# Altium schematic sheet EVENTCTRL_ACQ.SchDoc: ACQ
size A2; Author: ZLY; DocumentNumber: 2; Revision: 1.0; SheetNumber: 2; SheetTotal: 6
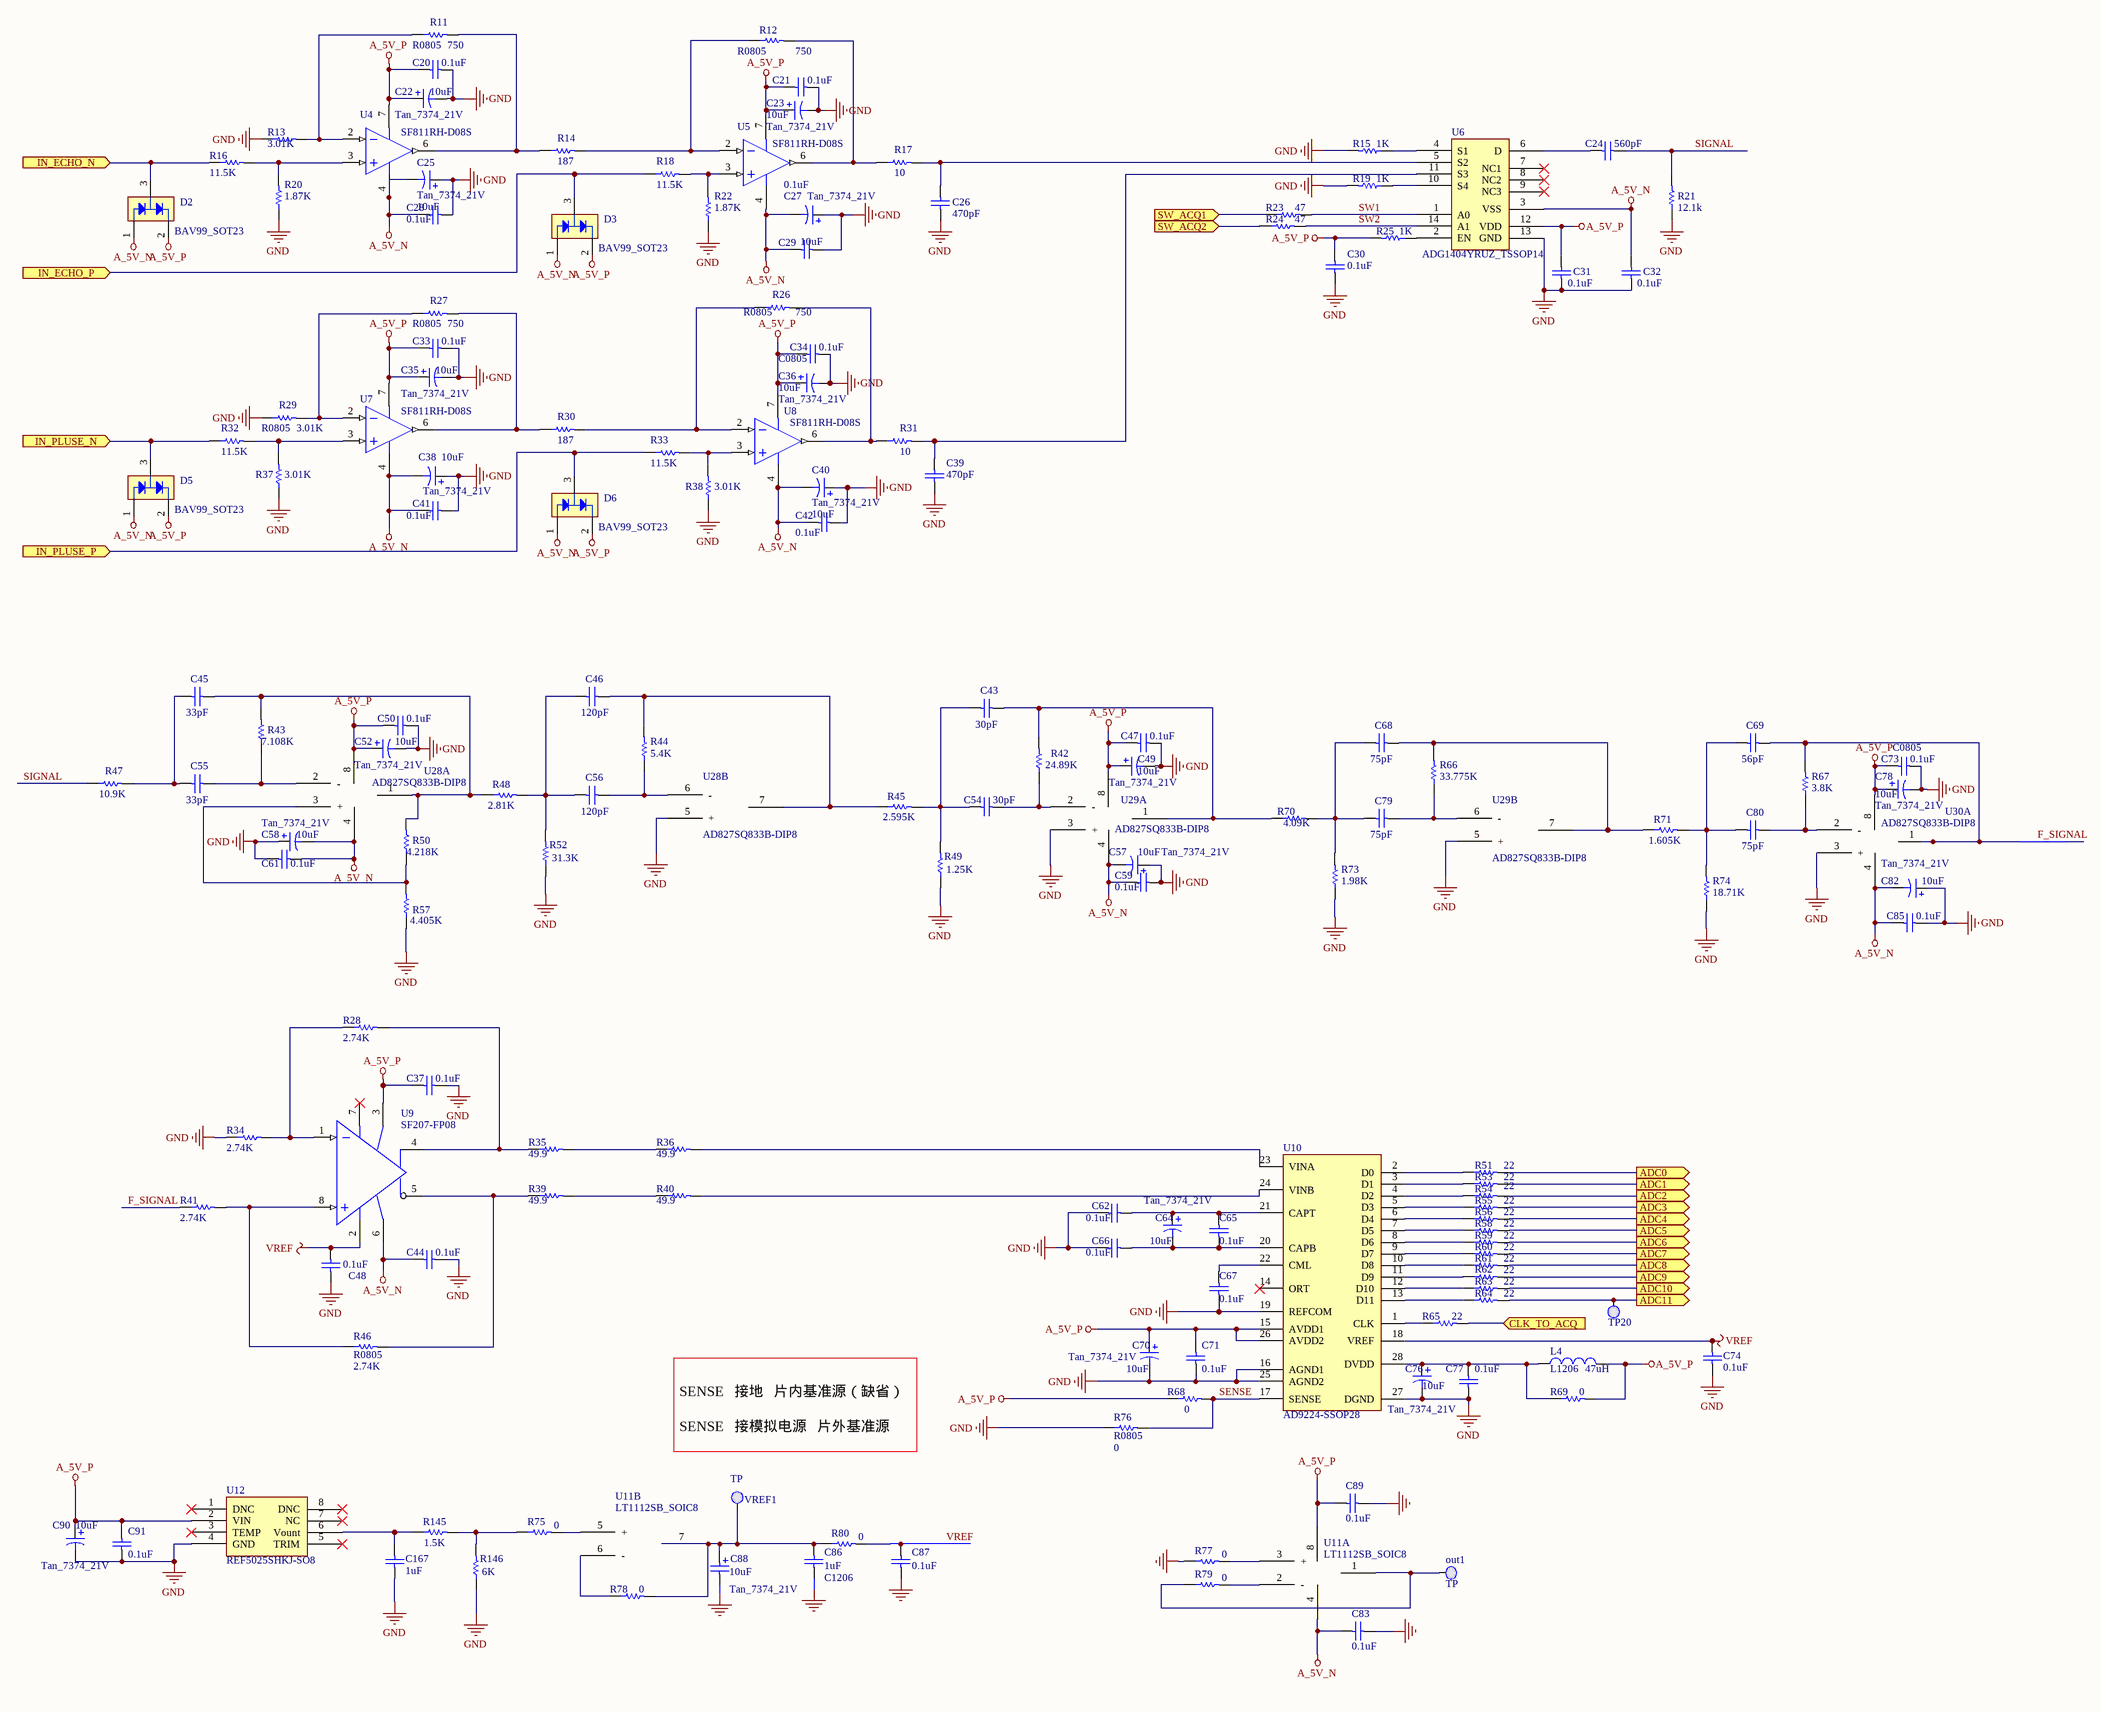
[diagram p0: EVENTCTRL_ACQ.SchDoc]

## Parts
C20  value 0.1uF  [0805]  (hidden comment: C0805)
C21  value 0.1uF  [0805]  (hidden comment: C0805)
C22  Tan_7374_21V  value 10uF  [7343]
C23  Tan_7374_21V  value 10uF  [7343]
C24  value 560pF  [0805]  (hidden comment: C0805)
C25  Tan_7374_21V  value 10uF  [7343]
C26  value 470pF  [0805]  (hidden comment: C0805)
C27  Tan_7374_21V  value 10uF  [7343]
C28  value 0.1uF  [0805]  (hidden comment: C0805)
C29  value 0.1uF  [0805]  (hidden comment: C0805)
C30  value 0.1uF  [0805]  (hidden comment: C0805)
C31  value 0.1uF  [0805]  (hidden comment: C0805)
C32  value 0.1uF  [0805]  (hidden comment: C0805)
C33  value 0.1uF  [0805]  (hidden comment: C0805)
C34  value 0.1uF  [0805]  (hidden comment: C0805)
C35  Tan_7374_21V  value 10uF  [7343]
C36  Tan_7374_21V  value 10uF  [7343]
C37  value 0.1uF  [0805]  (hidden comment: C0805)
C38  Tan_7374_21V  value 10uF  [7343]
C39  value 470pF  [0805]  (hidden comment: C0805)
C40  Tan_7374_21V  value 10uF  [7343]
C41  value 0.1uF  [0805]  (hidden comment: C0805)
C42  value 0.1uF  [0805]  (hidden comment: C0805)
C43  value 30pF  [0805]  (hidden comment: C0805)
C44  value 0.1uF  [0805]  (hidden comment: C0805)
C45  value 33pF  [0805]  (hidden comment: C0805)
C46  value 120pF  [0805]  (hidden comment: C0805)
C47  value 0.1uF  [0805]  (hidden comment: C0805)
C48  value 0.1uF  [0805]  (hidden comment: C0805)
C49  Tan_7374_21V  value 10uF  [7343]
C50  value 0.1uF  [0805]  (hidden comment: C0805)
C52  Tan_7374_21V  value 10uF  [7343]
C54  value 30pF  [0805]  (hidden comment: C0805)
C55  value 33pF  [0805]  (hidden comment: C0805)
C56  value 120pF  [0805]  (hidden comment: C0805)
C57  Tan_7374_21V  value 10uF  [7343]
C58  Tan_7374_21V  value 10uF  [7343]
C59  value 0.1uF  [0805]  (hidden comment: C0805)
C61  value 0.1uF  [0805]  (hidden comment: C0805)
C62  value 0.1uF  [0805]  (hidden comment: C0805)
C64  Tan_7374_21V  value 10uF  [7343]
C65  value 0.1uF  [0805]  (hidden comment: C0805)
C66  value 0.1uF  [0805]  (hidden comment: C0805)
C67  value 0.1uF  [0805]  (hidden comment: C0805)
C68  value 75pF  [0805]  (hidden comment: C0805)
C69  value 56pF  [0805]  (hidden comment: C0805)
C70  Tan_7374_21V  value 10uF  [7343]
C71  value 0.1uF  [0805]  (hidden comment: C0805)
C73  value 0.1uF  [0805]  (hidden comment: C0805)
C74  value 0.1uF  [0805]  (hidden comment: C0805)
C76  Tan_7374_21V  value 10uF  [7343]
C77  value 0.1uF  [0805]  (hidden comment: C0805)
C78  Tan_7374_21V  value 10uF  [7343]
C79  value 75pF  [0805]  (hidden comment: C0805)
C80  value 75pF  [0805]  (hidden comment: C0805)
C82  Tan_7374_21V  value 10uF  [7343]
C83  value 0.1uF  [0805]  (hidden comment: C0805)
C85  value 0.1uF  [0805]  (hidden comment: C0805)
C86  C1206  value 1uF  [1206]
C87  value 0.1uF  [0805]  (hidden comment: C0805)
C88  Tan_7374_21V  value 10uF  [7343]
C89  value 0.1uF  [0805]  (hidden comment: C0805)
C90  Tan_7374_21V  value 10uF  [7343]
C91  value 0.1uF  [0805]  (hidden comment: C0805)
C167  value 1uF  [1206]  (hidden comment: C1206)
D2  BAV99_SOT23  [SOT23-3N]
D3  BAV99_SOT23  [SOT23-3N]
D5  BAV99_SOT23  [SOT23-3N]
D6  BAV99_SOT23  [SOT23-3N]
L4  L1206  value 47uH  [1206]
out1  TP  [TPA]
R11  value 750  [R0805]  (hidden comment: R0805)
R12  R0805  value 750  [R0805]
R13  value 3.01K  [R0805]  (hidden comment: R0805)
R14  value 187  [R0805]  (hidden comment: R0805)
R15  value 1K  [R0805]  (hidden comment: R0805)
R16  value 11.5K  [R0805]  (hidden comment: R0805)
R17  value 10  [R0805]  (hidden comment: R0805)
R18  value 11.5K  [R0805]  (hidden comment: R0805)
R19  value 1K  [R0805]  (hidden comment: R0805)
R20  value 1.87K  [R0805]  (hidden comment: R0805)
R21  value 12.1k  [R0805]  (hidden comment: R0805)
R22  value 1.87K  [R0805]  (hidden comment: R0805)
R23  value 47  [R0805]  (hidden comment: R0805)
R24  value 47  [R0805]  (hidden comment: R0805)
R25  value 1K  [R0805]  (hidden comment: R0805)
R26  value 750  [R0805]  (hidden comment: R0805)
R27  value 750  [R0805]  (hidden comment: R0805)
R28  value 2.74K  [R0805]  (hidden comment: R0805)
R29  value 3.01K  [R0805]  (hidden comment: R0805)
R30  value 187  [R0805]  (hidden comment: R0805)
R31  value 10  [R0805]  (hidden comment: R0805)
R32  value 11.5K  [R0805]  (hidden comment: R0805)
R33  value 11.5K  [R0805]  (hidden comment: R0805)
R34  value 2.74K  [R0805]  (hidden comment: R0805)
R35  value 49.9  [R0805]  (hidden comment: R0805)
R36  value 49.9  [R0805]  (hidden comment: R0805)
R37  value 3.01K  [R0805]  (hidden comment: R0805)
R38  value 3.01K  [R0805]  (hidden comment: R0805)
R39  value 49.9  [R0805]  (hidden comment: R0805)
R40  value 49.9  [R0805]  (hidden comment: R0805)
R41  value 2.74K  [R0805]  (hidden comment: R0805)
R42  value 24.89K  [R0805]  (hidden comment: R0805)
R43  value 7.108K  [R0805]  (hidden comment: R0805)
R44  value 5.4K  [R0805]  (hidden comment: R0805)
R45  value 2.595K  [R0805]  (hidden comment: R0805)
R46  R0805  value 2.74K  [R0805]
R47  value 10.9K  [R0805]  (hidden comment: R0805)
R48  value 2.81K  [R0805]  (hidden comment: R0805)
R49  value 1.25K  [R0805]  (hidden comment: R0805)
R50  value 4.218K  [R0805]  (hidden comment: R0805)
R51  value 22  [R0805]  (hidden comment: R0805)
R52  value 31.3K  [R0805]  (hidden comment: R0805)
R53  value 22  [R0805]  (hidden comment: R0805)
R54  value 22  [R0805]  (hidden comment: R0805)
R55  value 22  [R0805]  (hidden comment: R0805)
R56  value 22  [R0805]  (hidden comment: R0805)
R57  value 4.405K  [R0805]  (hidden comment: R0805)
R58  value 22  [R0805]  (hidden comment: R0805)
R59  value 22  [R0805]  (hidden comment: R0805)
R60  value 22  [R0805]  (hidden comment: R0805)
R61  value 22  [R0805]  (hidden comment: R0805)
R62  value 22  [R0805]  (hidden comment: R0805)
R63  value 22  [R0805]  (hidden comment: R0805)
R64  value 22  [R0805]  (hidden comment: R0805)
R65  value 22  [R0805]  (hidden comment: R0805)
R66  value 33.775K  [R0805]  (hidden comment: R0805)
R67  value 3.8K  [R0805]  (hidden comment: R0805)
R68  value 0  [R0805]  (hidden comment: R0805)
R69  value 0  [R0805]  (hidden comment: R0805)
R70  value 4.09K  [R0805]  (hidden comment: R0805)
R71  value 1.605K  [R0805]  (hidden comment: R0805)
R73  value 1.98K  [R0805]  (hidden comment: R0805)
R74  value 18.71K  [R0805]  (hidden comment: R0805)
R75  value 0  [R0805]  (hidden comment: R0805)
R76  value 0  [R0805]  (hidden comment: R0805)
R77  value 0  [R0805]  (hidden comment: R0805)
R78  value 0  [R0805]  (hidden comment: R0805)
R79  value 0  [R0805]  (hidden comment: R0805)
R80  value 0  [R0805]  (hidden comment: R0805)
R145  value 1.5K  [R0805]  (hidden comment: R0805)
R146  value 6K  [R0805]  (hidden comment: R0805)
TP20  TP  [TPA]  (value not drawn)
U4  SF811RH-D08S  [DIP8]
U5  SF811RH-D08S  [DIP8]
U6  ADG1404YRUZ_TSSOP14  [TSSOP14]
U7  SF811RH-D08S  [DIP8]
U8  SF811RH-D08S  [DIP8]
U9  SF207-FP08  [SO-8]
U10  AD9224-SSOP28  [TSSOP28]
U11  LT1112SB_SOIC8  [SO-8]  (parts A,B of 2)
U12  REF5025SHKJ-SO8  [SO8-HKJ]
U28  AD827SQ833B-DIP8  [DIP8]  (parts A,B of 2)
U29  AD827SQ833B-DIP8  [DIP8]  (parts A,B of 2)
U30  AD827SQ833B-DIP8  [DIP8]  (part A of 2)
VREF1  TP  [TPA]

## Ports
ADC0 (out), ADC1 (out), ADC2 (out), ADC3 (out), ADC4 (out), ADC5 (out), ADC6 (out), ADC7 (out), ADC8 (out), ADC9 (out), ADC10 (out), ADC11 (out), CLK_TO_ACQ (in), IN_ECHO_N (in), IN_ECHO_P (in), IN_PLUSE_N (in), IN_PLUSE_P (in), SW_ACQ1 (in), SW_ACQ2 (in)

## Nets
A_5V_N: C25.2 C27.2 C28.1 C29.1 C32.1 C38.2 C40.2 C41.1 C42.1 C44.1 C57.2 C58.2 C59.1 C61.2 C82.2 C83.2 C85.1 D2.1 D3.1 D5.1 D6.1 U4.4(-VS) U5.4(-VS) U6.3(VSS) U7.4(-VS) U8.4(-VS) U9.6(V-) U11.4 U28.4 U29.4 U30.4
A_5V_P: C20.1 C21.1 C22.1 C23.1 C30.1 C31.1 C33.1 C34.1 C35.1 C36.1 C37.1 C47.1 C49.1 C50.1 C52.1 C70.1 C71.1 C73.1 C78.1 C89.1 C90.1 C91.2 D2.2 D3.2 D5.2 D6.2 L4.2 R25.2 R68.1 R69.2 U4.7(+VS) U5.7(+VS) U6.12(VDD) U7.7(+VS) U8.7(+VS) U9.3(V+) U10.15(AVDD1) U10.26(AVDD2) U11.8 U12.2(VIN) U28.8 U29.8 U30.8
GND: C20.2 C21.2 C22.2 C23.2 C25.1 C26.2 C27.1 C28.2 C29.2 C30.2 C31.2 C32.2 C33.2 C34.2 C35.2 C36.2 C37.2 C38.1 C39.2 C40.1 C41.2 C42.2 C44.2 C47.2 C48.2 C49.2 C50.2 C52.2 C57.1 C58.1 C59.2 C61.1 C62.1 C66.1 C67.2 C70.2 C71.2 C73.2 C74.2 C76.2 C77.2 C78.2 C82.1 C83.1 C85.2 C86.2 C87.2 C88.2 C89.2 C90.2 C91.1 C167.1 R13.1 R15.2 R19.2 R20.1 R21.1 R22.1 R29.1 R34.1 R37.1 R38.1 R49.1 R52.1 R57.1 R73.1 R74.1 R76.1 R77.1 R146.1 U6.13(GND) U10.16(AGND1) U10.19(REFCOM) U10.25(AGND2) U10.27(DGND) U12.4(GND) U28.5(+) U29.3(+) U29.5(+) U30.3(+)
VREF: C48.1 C74.1 C87.1 R80.2 U9.2(Vcom) U10.18(VREF)
ADC0: R51.2 ; port ADC0
ADC1: R53.2 ; port ADC1
ADC2: R54.2 ; port ADC2
ADC3: R55.2 ; port ADC3
ADC4: R56.2 ; port ADC4
ADC5: R58.2 ; port ADC5
ADC6: R59.2 ; port ADC6
ADC7: R60.2 ; port ADC7
ADC8: R61.2 ; port ADC8
ADC9: R62.2 ; port ADC9
ADC10: R63.2 ; port ADC10
ADC11: R64.2 TP20.1(TP) ; port ADC11
CLK_TO_ACQ: R65.2 ; port CLK_TO_ACQ
F_SIGNAL: C69.2 R41.1 R67.2 U30.1(OUTA)
IN_ECHO_N: D2.3 R16.1 ; port IN_ECHO_N
IN_ECHO_P: D3.3 R18.1 ; port IN_ECHO_P
IN_PLUSE_N: D5.3 R32.1 ; port IN_PLUSE_N
IN_PLUSE_P: D6.3 R33.1 ; port IN_PLUSE_P
SENSE: R68.2 R76.2 U10.17(SENSE)
SIGNAL: C24.2 R21.2 R47.1
SW1: R23.2 U6.1(A0)
SW2: R24.2 U6.14(A1)
SW_ACQ1: R23.1 ; port SW_ACQ1
SW_ACQ2: R24.1 ; port SW_ACQ2
NetC24_1: C24.1 U6.6(D)
NetC26_1: C26.1 R17.2 U6.5(S2)
NetC39_1: C39.1 R31.2 U6.11(S3)
NetC43_1: C43.1 C54.1 R45.2 R49.2
NetC43_2: C43.2 R42.2 R70.1 U29.1(OUTA)
NetC45_1: C45.1 R43.2 R48.1 R50.2 U28.1(OUTA)
NetC45_2: C45.2 C55.2 R47.2
NetC46_1: C46.1 C56.1 R48.2 R52.2
NetC46_2: C46.2 R44.2 R45.1 U28.7(OUTB)
NetC54_2: C54.2 R42.1 U29.2(-)
NetC55_1: C55.1 R43.1 U28.2(-)
NetC56_2: C56.2 R44.1 U28.6(-)
NetC62_2: C62.2 C64.1 C65.1 U10.21(CAPT)
NetC64_2: C64.2 C65.2 C66.2 U10.20(CAPB)
NetC67_1: C67.1 U10.22(CML)
NetC68_1: C68.1 C79.1 R70.2 R73.2
NetC68_2: C68.2 R66.2 R71.1 U29.7(OUTB)
NetC69_1: C69.1 C80.1 R71.2 R74.2
NetC76_1: C76.1 C77.1 L4.1 R69.1 U10.28(DVDD)
NetC79_2: C79.2 R66.1 U29.6(-)
NetC80_2: C80.2 R67.1 U30.2(-)
NetC86_1: C86.1 C88.1 R78.2 R80.1 U11.7(OUTB) VREF1.1(TP)
NetC167_2: C167.2 R145.1 U12.6(Vount)
Netout1_1: out1.1(TP) R79.1 U11.1(OUTA)
NetR11_1: R11.1 R13.2 U4.2(-IN)
NetR11_2: R11.2 R14.1 U4.6(OUT)
NetR12_1: R12.1 R14.2 U5.2(-IN)
NetR12_2: R12.2 R17.1 U5.6(OUT)
NetR15_1: R15.1 U6.4(S1)
NetR16_2: R16.2 R20.2 U4.3(+IN)
NetR18_2: R18.2 R22.2 U5.3(+IN)
NetR19_1: R19.1 U6.10(S4)
NetR25_1: R25.1 U6.2(EN)
NetR26_1: R26.1 R30.2 U8.2(-IN)
NetR26_2: R26.2 R31.1 U8.6(OUT)
NetR27_1: R27.1 R29.2 U7.2(-IN)
NetR27_2: R27.2 R30.1 U7.6(OUT)
NetR28_1: R28.1 R34.2 U9.1(Din-)
NetR28_2: R28.2 R35.1 U9.4(OUT+)
NetR32_2: R32.2 R37.2 U7.3(+IN)
NetR33_2: R33.2 R38.2 U8.3(+IN)
NetR35_2: R35.2 R36.1
NetR36_2: R36.2 U10.23(VINA)
NetR39_1: R39.1 R46.2 U9.5(OUT-)
NetR39_2: R39.2 R40.1
NetR40_2: R40.2 U10.24(VINB)
NetR41_2: R41.2 R46.1 U9.8(Din+)
NetR50_1: R50.1 R57.2 U28.3(+)
NetR51_1: R51.1 U10.2(D0)
NetR53_1: R53.1 U10.3(D1)
NetR54_1: R54.1 U10.4(D2)
NetR55_1: R55.1 U10.5(D3)
NetR56_1: R56.1 U10.6(D4)
NetR58_1: R58.1 U10.7(D5)
NetR59_1: R59.1 U10.8(D6)
NetR60_1: R60.1 U10.9(D7)
NetR61_1: R61.1 U10.10(D8)
NetR62_1: R62.1 U10.11(D9)
NetR63_1: R63.1 U10.12(D10)
NetR64_1: R64.1 U10.13(D11)
NetR65_1: R65.1 U10.1(CLK)
NetR75_1: R75.1 R145.2 R146.2
NetR75_2: R75.2 U11.5(+)
NetR77_2: R77.2 U11.3(+)
NetR78_1: R78.1 U11.6(-)
NetR79_2: R79.2 U11.2(-)

Not connected (* = marked no-connect by the designer): U6 7(NC1)* 8(NC2)* 9(NC3)*; U9 7(NC)*; U10 14(ORT)*; U12 1(DNC)* 3(TEMP)* 5(TRIM)* 7(NC)* 8(DNC)*

## Notes on the sheet
- SENSE   接地   片内基准源（缺省）
- SENSE   接模拟电源   片外基准源

## Library data of the parts
C20 C21 C24 C26 C28-C34 C37 C39 C41-C48 C50 C54-C56 C59 C61 C62 C65-C69 C71 C73 C74 C77 C79 C80 C85 C91 C167 = Cap: Capacitor
  C20 C21 C24 C26 C28-C34 C37 C39 C41 C42 C44 C47 C48 C50 C59 C61 C62 C65-C67 C71 C73 C74 C77 C85 C91: PackageReference: C0805
  C43 C45 C46 C54-C56 C68 C69 C79 C80: Published: 8-Jun-2000; LatestRevisionDate: 17-Jul-2002; LatestRevisionNote: Re-released for DXP Platform.; PackageReference: RAD-0.3; Publisher: Altium Limited; PackageDescription: Radial Cap, Thru-Hole; 2 Leads; 0.3 in Pin Spacing
  C167: PackageReference: C1206
C22 C23 C25 C27 C35 C36 C38 C40 C49 C52 C58 C78 C90 = Cap Pol3: Polarized Capacitor (Surface Mount); 耐压值: 21V; Published: 8-Jun-2000; LatestRevisionDate: 17-Jul-2002; LatestRevisionNote: Re-released for DXP Platform.; PackageReference: C0805; Publisher: Altium Limited
C57 C82 = Cap Pol3: Polarized Capacitor (Surface Mount); Published: 8-Jun-2000; LatestRevisionDate: 17-Jul-2002; LatestRevisionNote: Re-released for DXP Platform.; PackageReference: C0805; Publisher: Altium Limited
C64 = Cap Pol1: Polarized Capacitor (Radial); 耐压值: 21V
C70 C76 = Cap Pol1: Polarized Capacitor (Radial)
C83 C86 C87 C89 = Y20021820: Capacitor; 制造商型号: 08053C104K4Z; 精度: ±10%; 描述: AVX;08053C104K4Z;0.1uF;±10%;25V;X7R;125℃;CAP0805; 安装形式: SMT; 产品外形尺寸<长>: 2.0±0.2mm; 产品外形尺寸<宽>: 1.25±0.2mm; 产品外形尺寸<高>: 0.94mm; id: wt.part.WTPartMaster:1051426; state: APPROVED; folder: /Default/电容/0805YC104JAT; Part Number: Y20021820; HelpURL: \\10.185.226.160\altium_center_db\DATASHEET\AVX Automotive MLCC.pdf; pname: 08053C104K4Z
C88 = Y20024818: Polarized Capacitor; 制造商型号: T499D106K050AT; 精度: ±10%; 描述: KEMET;T499D106K050AT;10uF;±10%;50V;175℃;CAP2917; 安装形式: SMT; 产品外形尺寸<长>: 7.3±0.30mm; 产品外形尺寸<宽>: 4.3±0.30mm; 产品外形尺寸<高>: 2.8±0.30mm; id: wt.part.WTPartMaster:1056718; state: APPROVED; folder: /Default/电容/T499D106K050AT; 耐压值: 21V; Part Number: Y20024818; HelpURL: \\10.185.226.160\altium_center_db\DATASHEET\KEMET T498&T499ns.pdf; pname: T499D106K050AT
D2 D3 D5 D6 = BAV99LT1
L4 = Inductor
R11-R71 R73-R80 R145 R146 = Res1: Resistor
  R11 R13 R15-R41 R65 R68 R69 R76: PackageReference: R0805
  R12 R14 R51 R53-R56 R58-R64: Published: 8-Jun-2000; LatestRevisionDate: 17-Jul-2002; LatestRevisionNote: Re-released for DXP Platform.; PackageReference: AXIAL-0.3; Publisher: Altium Limited
  R42-R45 R47-R50 R52 R57 R66 R67 R70 R71 R73-R75 R77-R80 R145 R146: Published: 8-Jun-2000; LatestRevisionDate: 17-Jul-2002; LatestRevisionNote: Re-released for DXP Platform.; PackageReference: AXIAL-0.3; Publisher: Altium Limited; PackageDescription: Axial Device, Thru-Hole; 2 Leads; 0.3 in Pin Spacing
U4 U5 U7 U8 = AD811
U6 = ADG1404
U9 = SF207
U10 = AD9224
U11 = LT1112SB
U12 = Component_1
U28-U30 = AD827